# EAGLE design HM-RC-8_Remote-v03-019 (EAGLE 9.5.0)
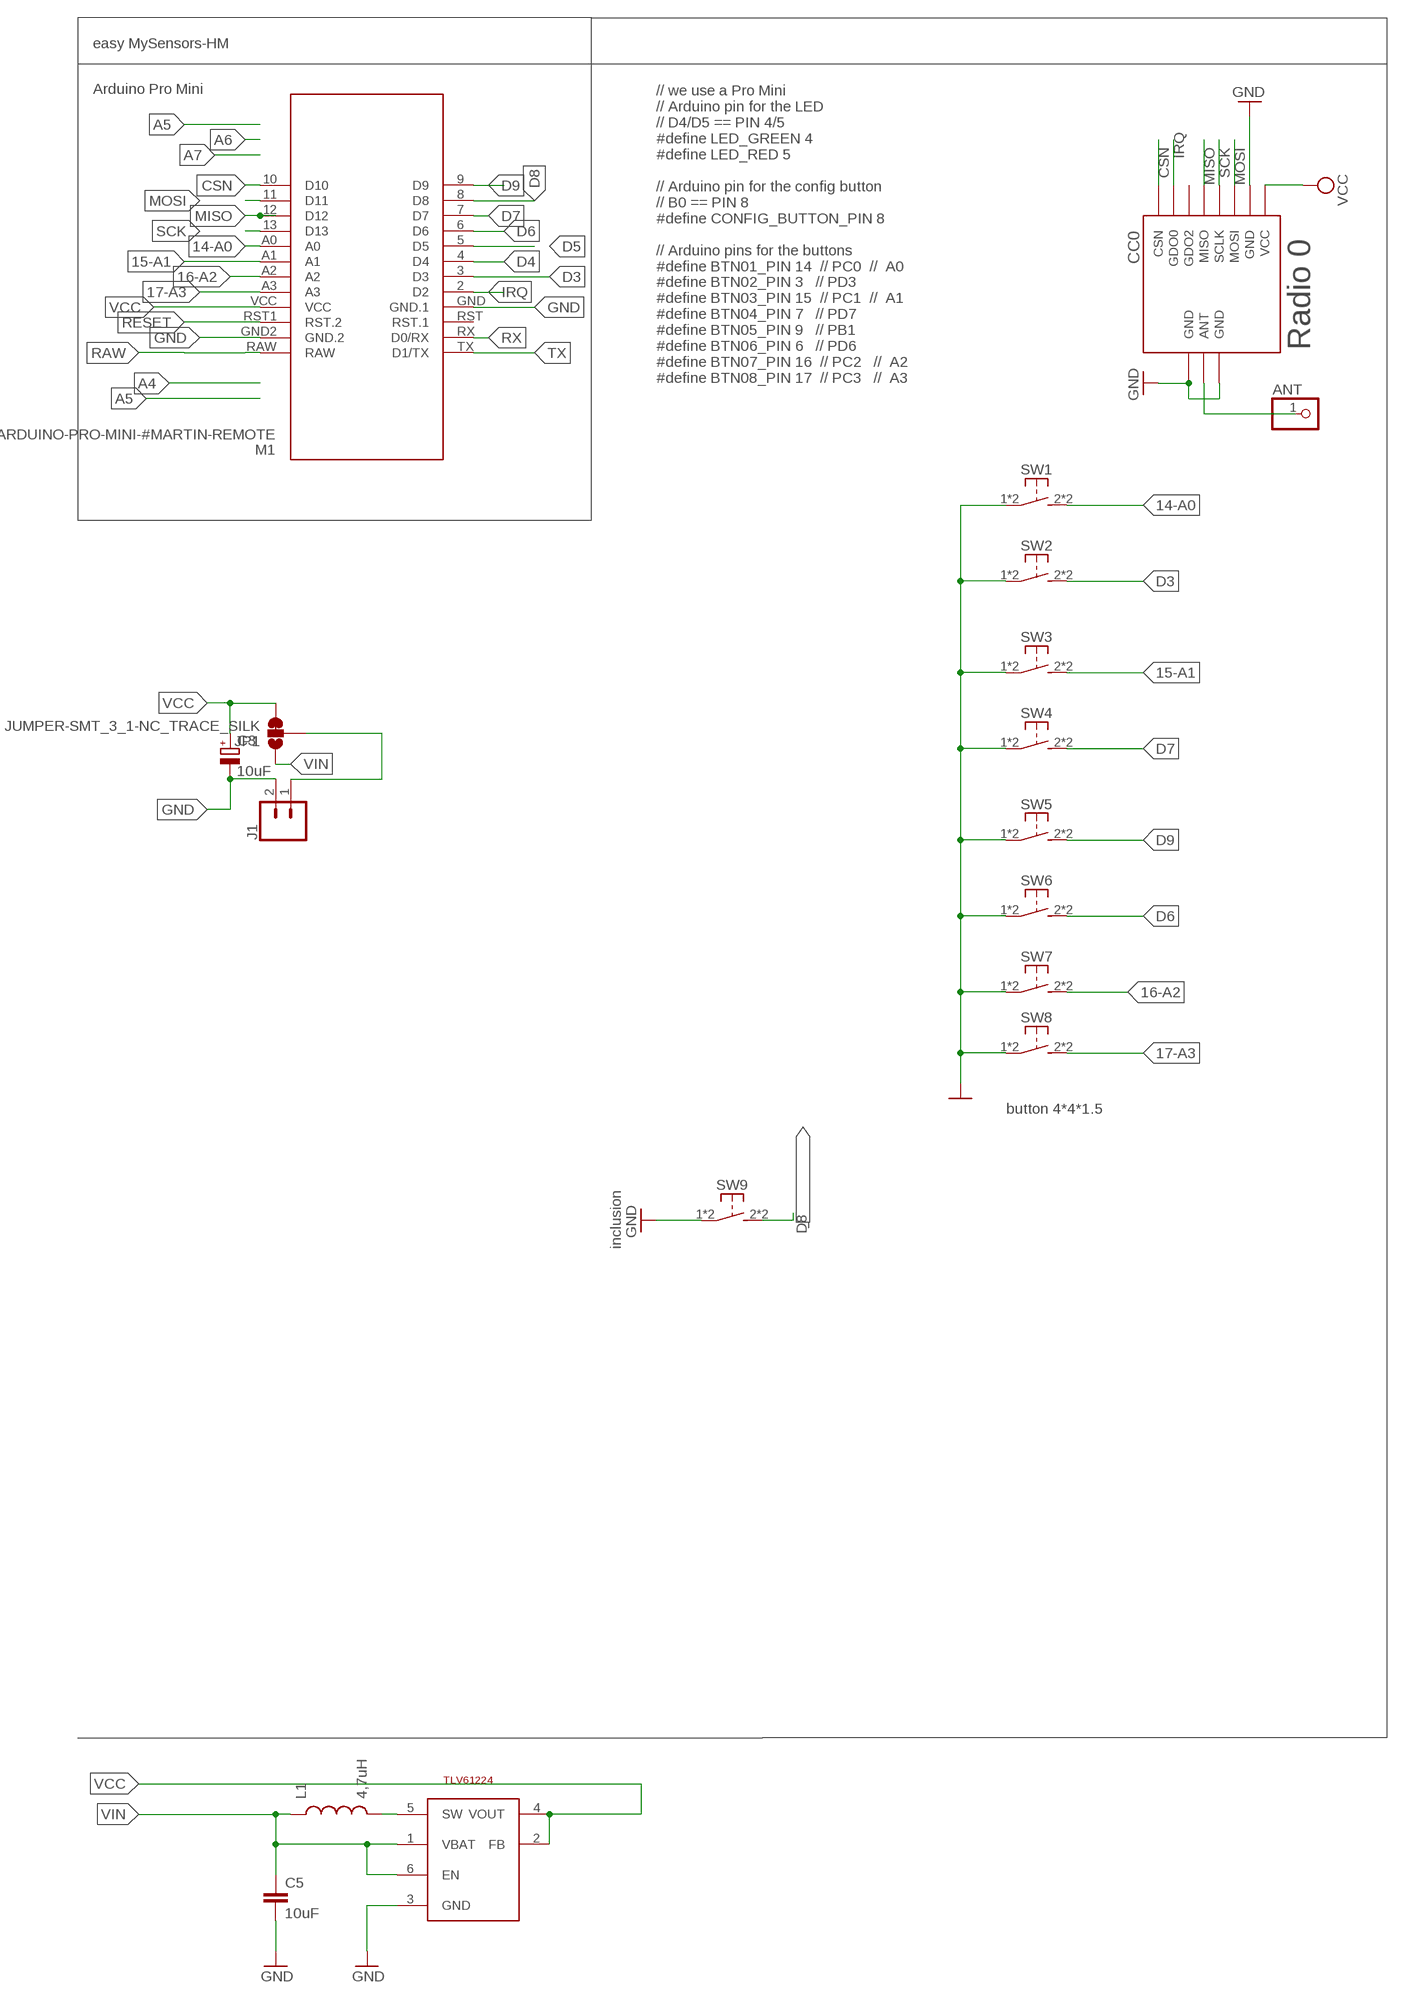
[diagram p0: schematic, sheet 1]

## Parts
ANT  PINHD-1X1  [1X01]
C3  10uF  CPOL-EUSMCC  [SMC_C]
C5  10uF  CAP0805  [0805]
CC0  CC1101  CC1101_MODULE1SMD  [CC1101_MODULE1_SMD]
J1  CONN_02PTH3  [1X02_LONGPADS]
JP1  JUMPER-SMT_3_1-NC_TRACE_SILK  [SMT-JUMPER_3_1-NC_TRACE_SILK]
L1  4,7uH  INDUCTOR0805  [0805]
M1  ARDUINO-PRO-MINI-#MARTIN-REMOTE  [ARDUINO-PRO-MINI#NP-MARTIN-REMOTE]
STEPUP  TLV61224  TI-TLV61224  [SOT23-6L]
SW1  SW-TACTILE-TL3305  [TL3305]
SW2  SW-TACTILE-TL3305  [TL3305]
SW3  SW-TACTILE-TL3305  [TL3305]
SW4  SW-TACTILE-TL3305  [TL3305]
SW5  SW-TACTILE-TL3305  [TL3305]
SW6  SW-TACTILE-TL3305  [TL3305]
SW7  SW-TACTILE-TL3305  [TL3305]
SW8  SW-TACTILE-TL3305  [TL3305]
SW9  SW-TACTILE-TL3305  [TL3305]

## Nets
14-A0: M1.A0 SW1.2(S1) SW1.3(S1)
15-A1: M1.A1 SW3.2(S1) SW3.3(S1)
16-A2: M1.A2 SW7.2(S1) SW7.3(S1)
17-A3: M1.A3 SW8.2(S1) SW8.3(S1)
ANT0: ANT.1 CC0.ANT
CSN: CC0.CSN M1.10(D10)
D3: M1.3(D3) SW2.2(S1) SW2.3(S1)
D4: M1.4(D4)
D5: M1.5(D5)
D6: M1.6(D6) SW6.2(S1) SW6.3(S1)
D7: M1.7(D7) SW4.2(S1) SW4.3(S1)
D8: M1.8(D8) SW9.2(S1) SW9.3(S1)
D9: M1.9(D9) SW5.2(S1) SW5.3(S1)
GND [Power]: C3.- C5.2 CC0.GND@0(GND) CC0.GND@1(GND) CC0.GND@2(GND) J1.2 M1.GND2(GND.2) M1.GND(GND.1) STEPUP.3(GND) SW1.1 SW1.4(P1) SW2.1 SW2.4(P1) SW3.1 SW3.4(P1) SW4.1 SW4.4(P1) SW5.1 SW5.4(P1) SW6.1 SW6.4(P1) SW7.1 SW7.4(P1) SW8.1 SW8.4(P1) SW9.1 SW9.4(P1)
IRQ: CC0.GDO0 M1.2(D2)
MISO: CC0.MISO M1.12(D12)
MOSI: CC0.MOSI M1.11(D11)
N$4: J1.1 JP1.2
N$13: L1.2 STEPUP.5(SW)
RAW [Power]: M1.RAW
RESET: M1.RST1(RST.2)
RX: M1.RX(D0/RX)
SCK: CC0.SCLK M1.13(D13)
TX: M1.TX(D1/TX)
VCC [Power]: C3.+ CC0.VCC JP1.3 M1.VCC STEPUP.2(FB) STEPUP.4(VOUT)
VIN: C5.1 JP1.1 L1.1 STEPUP.1(VBAT) STEPUP.6(EN)
Unconnected: CC0.GDO2 M1.RST(RST.1)

## Notes on the sheet
- easy MySensors-HM
- Arduino Pro Mini
- Radio 0
- // we use a Pro Mini
  // Arduino pin for the LED
  // D4/D5 == PIN 4/5
  #define LED_GREEN 4
  #define LED_RED 5
  
  // Arduino pin for the config button
  // B0 == PIN 8
  #define CONFIG_BUTTON_PIN 8
  
  // Arduino pins for the buttons
  #define BTN01_PIN 14  // PC0  //  A0
  #define BTN02_PIN 3   // PD3  
  #define BTN03_PIN 15  // PC1  //  A1
  #define BTN04_PIN 7   // PD7
  #define BTN05_PIN 9   // PB1
  #define BTN06_PIN 6   // PD6
  #define BTN07_PIN 16  // PC2   //  A2
  #define BTN08_PIN 17  // PC3   //  A3
- button 4*4*1.5
- inclusion

## Library data of the parts
ANT = pinhead:PINHD-1X1: PIN HEADER
C3 = rcl:CPOL-EU: POLARIZED CAPACITOR, European symbol; SPICEPREFIX: C
C5 = SparkFun-Passives:CAP: Capacitor Standard 0603 ceramic capacitor, and 0.1" leaded capacitor.
CC0 = wireless:CC1101_MODULE1: CC1101 wireless module for 433/868 MHz (sold from Aliexpress). DIL version for mounting with pin header (and SMD soldering) and SMD only variant available.
J1 = SparkFun-Connectors:CONN_02: Multi connection point. Often used as Generic Header-pin footprint for 0.1 inch spaced/style header connections On any of the 0.1 inch spaced packages, you can populate with these: Break Away Headers - Straight <https://www.sparkfun.com/products/116> (PRT-00116) Break Away Male Headers - Right Angle <https://www.sparkfun.com/products/553> (PRT-00553) Female Headers <https://www.sparkfun.com/products/115> (PRT-00115) Break Away Headers - Machine Pin <https://www.sparkfun.com/products/117> (PRT-00117) Break Away Female Headers - Swiss Machine Pin <https://www.sparkfun.com/products/743> (PRT-00743) For SCREWTERMINALS and SPRING TERMINALS visit here: Screw Terimnals on SparkFun.com <https://www.sparkfun.com/search/results?term=Screw+Terminals> (5mm/3.5mm/2.54mm spacing) This device is also useful as a general connection point to wire up your design to another part of your project. Our various solder wires solder well into these plated through hole pads. Hook-Up Wire - Assortment (Stranded, 22 AWG) <https://www.sparkfun.com/products/11375> (PRT-11375) Hook-Up Wire - Assortment (Solid Core, 22 AWG) <https://www.sparkfun.com/products/11367> (PRT-11367) View the entire wire category on our website here <https://www.sparkfun.com/categories/141> Special notes: Molex polarized connector foot print use with: PRT-08233 with associated crimp pins and housings. 2.54_SCREWTERM for use with PRT-10571. 3.5mm Screw Terminal footprints for PRT-08084 5mm Screw Terminal footprints for use with PRT-08432
JP1 = SparkFun-Jumpers:JUMPER-SMT_3_1-NC_TRACE: Normally closed trace jumper (1 of 2 connections) This jumper has a trace between two pads so it's normally closed (NC). The other connection is normally open (NO). Use a razor knife to open the connection. For best results follow the IPC guidelines for cutting traces: Cutout at least 0.063 mm (0.005 in). Remove all loose material to clean up the cut area. Seal the cut with an approved epoxy. Reapply solder to reclose the connection, or to close the NO connection.
L1 = SparkFun-Passives:INDUCTOR: Inductors Basic Inductor/Choke - 0603 and 1206. Footprints are not proven and vary greatly between part numbers.
M1 = diy-modules-Martin:ARDUINO-PRO-MINI-*#MARTIN-REMOTE: Arduino Pro Mini (and compatible devices) without programming pads More details available here: https://www.arduino.cc/en/Main/ArduinoBoardProMini Click here to find device on ebay.com <http://www.ebay.com/sch/arduino+pro+mini>
STEPUP = TLV61224:TI-TLV61224
SW1-SW9 = we-switch:SW-TACTILE: Tactile Switches

## Net classes
0 default: width 0.305 mm
1 Power: width 0.508 mm

## Board
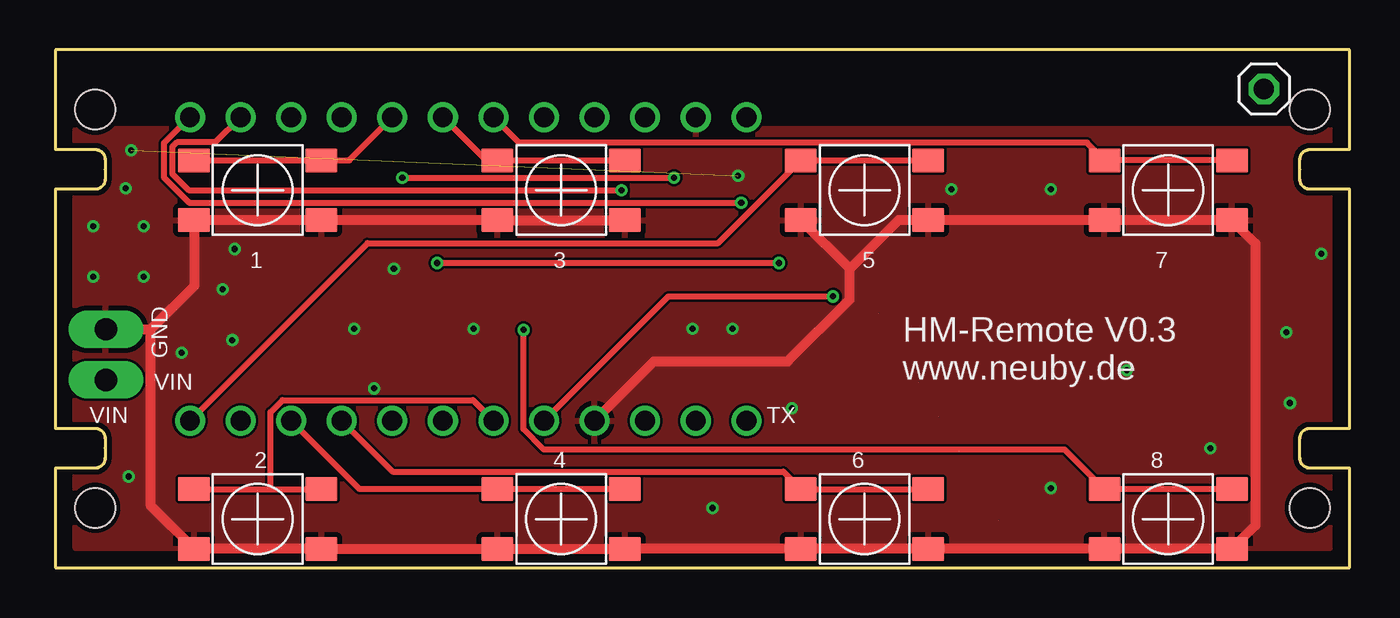
[diagram p1: board, top side]
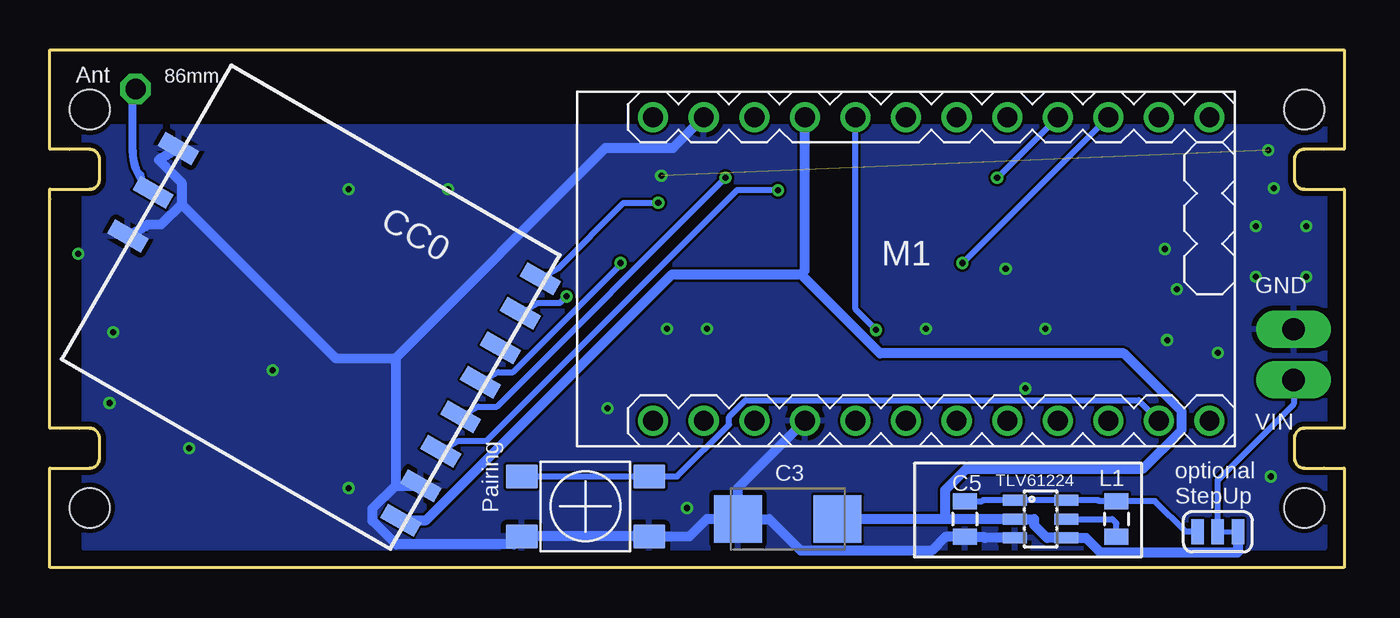
[diagram p2: board, bottom side, seen from below]

Size 65 x 26 mm. Coordinates in mm from the lower left corner, seen from the top.
Outline: 0,0 65,0 65,5 63,5 arc-90 62.5,5.5 62.5,6.5 arc-90 63,7 63.5,7 64.5,7 65,7 65,18.5 65,19 63,19 arc-90 62.5,19.5 62.5,20 62.5,20.5 arc-90 63,21 64,21 65,21 65,26 0,26 0,21 1,21 2,21 arc-90 2.5,20.5 2.5,20 2.5,19.5 arc-90 2,19 0,19 0,7 2,7 arc-90 2.5,6.5 2.5,6 2.5,5.5 arc-90 2,5 1,5 0,5 0,0
Copper layers (1*16): Top 0.035mm / dielectric 1.5mm / Bottom 0.035mm
Design rules "dirt_cheap_dirty_boards.v1": minimum track width 5mil, minimum drill 12mil, track to track 5mil, track to pad 5mil, pad to pad 5mil, via to via 5mil, smd to smd 0mil, copper to edge 10mil, drill to drill 10mil, minimum pad ring 10mil, minimum via ring 6mil, stop-mask expansion 2mil, vias tented up to drill 25mil, thermal gap 10mil
Holes 2 mm at 2,3 2,23 63,23 63,3
tRestrict: area 1,24 to 59,26
bRestrict: area 1,24 to 59,26

### Footprints (pad centres in the part's own frame; a part is rotated, then mirrored left to right if it is on the bottom)
1X01 = drill 1.016 octagon: 1 0,0
SMC_C = smd 2.4 x 2.4: + -2.5,0; - 2.5,0
0805 = smd 0.8 x 1.2: 1 -0.9,0; 2 0.9,0
CC1101_MODULE1_SMD = smd 1.93 x 0.813: ANT 19,5.96; CSN 0,0; GDO0 0,2; GDO2 0,4; GND@0 0,12; GND@1 19,8.5; GND@2 19,3.42; MISO 0,6; MOSI 0,10; SCLK 0,8; VCC 0,14
1X02_LONGPADS = drill 1.118 pad 1.88 long: 1 0,0; 2 2.54,0
SMT-JUMPER_3_1-NC_TRACE_SILK = smd 0.635 x 1.27: 1 -1.016,0; 2 0,0; 3 1.016,0
ARDUINO-PRO-MINI#NP-MARTIN-REMOTE = drill 1: 2 -2.54,-7.62; 3 0,-7.62; 4 2.54,-7.62; 5 5.08,-7.62; 6 7.62,-7.62; 7 10.16,-7.62; 8 12.7,-7.62; 9 15.24,-7.62; 10 15.24,7.62; 11 12.7,7.62; 12 10.16,7.62; 13 7.62,7.62; A0 5.08,7.62; A1 2.54,7.62; A2 0,7.62; A3 -2.54,7.62; GND -10.16,7.62; GND2 -5.08,-7.62; RAW -12.7,7.62; RST -7.62,7.62; RST1 -7.62,-7.62; RX -10.16,-7.62; TX -12.7,-7.62; VCC -5.08,7.62
SOT23-6L = smd 0.55 x 1.2: 1 -0.95,-1.3; 2 0,-1.3; 3 0.95,-1.3; 4 0.95,1.3; 5 0,1.3; 6 -0.95,1.3
TL3305 = smd 1.6 x 1.2: 1 -3.2,1.5; 2 -3.2,-1.5; 3 3.2,-1.5; 4 3.2,1.5

### Placement (x,y rotation side)
ANT  60.69,24.04 0 top
C3  27.94,2.44 180 bottom
C5  19.05,2.44 270 bottom
CC0  40.37,14.51 150 bottom
J1  2.54,9.43 90 top
JP1  6.35,1.81 0 bottom
L1  11.43,2.44 270 bottom
M1  22,15 0 bottom
STEPUP  15.24,2.44 270 bottom
SW1  10.16,18.95 180 top
SW2  10.16,2.44 180 top
SW3  25.4,18.95 180 top
SW4  25.4,2.44 180 top
SW5  40.64,18.95 180 top
SW6  40.64,2.44 180 top
SW7  55.88,18.95 180 top
SW8  55.88,2.44 180 top
SW9  38.1,3.08 180 bottom

### Tracks (layer width: path | path; a pad name or v marks a point on that pad's centre or on a via)
14-A0
  Top 0.305: M1.A0 14.76,20.45 SW1.2 SW1.3
15-A1
  Top 0.305: SW3.2 SW3.3 21.62,20.45 M1.A1
16-A2
  Top 0.305: M1.A2 23.29,21.33 51.8,21.33 SW7.3 SW7.2
17-A3  (via drill 0.3 pad 0.61)
  Top 0.305: v23.5,11.94 23.5,6.95 24.52,5.93 50.69,5.93 SW8.3 SW8.2
  Bottom 0.305: v23.5,11.94 24.54,12.97 M1.A3
ANT0
  Bottom 0.305: CC0.ANT 60.3,19.34 arc45 60.45,19.72
  Bottom 0.406: 60.45,19.72 arc-45 60.3,19.34 CC0.ANT 60.09,19.13 arc45 60.83,20.93 60.83,23.69 arc45 ANT.1
CSN  (via drill 0.3 pad 0.61)
  Top 0.305: M1.10 5.45,21.32 5.45,19.6 6.71,18.33 34.42,18.33 v34.44,18.32
  Bottom 0.305: v34.44,18.32 36.19,18.32 39.49,15.02 CC0.CSN
D3
  Top 0.305: 10.8,3.94 SW2.2 | SW2.3 10.8,3.94 | 10.8,3.94 10.8,7.81 11.41,8.41 20.97,8.41 M1.3
D6
  Top 0.305: M1.6 16.93,4.83 36.56,4.83 SW6.3 SW6.2
D7
  Top 0.305: M1.7 15.28,3.94 SW4.3 SW4.2
D8
  Bottom 0.305: M1.8 10.34,8.41 30.05,8.41 30.89,7.58 30.89,7.18 33.49,4.58 SW9.2 SW9.3
D9
  Top 0.305: SW5.2 SW5.3 33.29,16.3 15.68,16.3 M1.9
GND  (via drill 0.3 pad 0.61)  (1 unrouted)
  Top 0.508: 39.89,15 SW5.4 | M1.GND2 30.06,10.36 36.77,10.36 39.89,13.48 39.89,15 | 39.89,15 42.34,17.45 SW5.1 SW7.4 SW7.1 60.26,16.27 60.26,2.13 SW8.1 SW8.4 SW6.1 SW6.4 SW4.1 SW4.4 SW2.1 SW2.4 4.8,3.1 4.8,11.97 | 4.8,11.97 6.96,14.13 SW1.4 SW1.1 SW3.4 SW3.1 | J1.2 4.8,11.97
  Bottom 0.508: 47.65,10.53 37.09,21.08 33.7,21.08 M1.GND | 58.38,18.26 50.65,10.53 47.65,10.53 | 47.65,10.53 47.65,4.12 | 47.65,4.12 CC0.GND@0 | 47.65,4.12 48.79,2.97 48.79,2.35 47.61,1.17 41.71,1.17 SW9.4 SW9.1 32.89,1.58 32.02,2.44 C3.- | 58.38,18.26 58.38,19.33 59.53,20.47 CC0.GND@2 | 58.38,18.26 59.42,17.22 60.08,17.22 | 60.08,17.22 | C3.- 28.86,2.44 27.28,0.86 20.71,0.86 20.03,1.54 C5.2 18.56,1.54 18.07,1.54 18.02,1.5 STEPUP.3 | CC0.GND@1 60.08,17.22 | C3.- 30.44,4.03 30.43,4.03 M1.GND2
  other vias: 3.67,4.58 8.4,13.98 1.91,14.61 4.45,14.61 3.81,20.95 3.54,19.05 1.91,17.14 34.29,19.68 4.45,17.14 8.89,11.43 6.35,10.79 9,16 15,12 17,15 21,12 16,9 32,12 34,12 37,8 33,3 50,4 58,6 61.81,11.82 50,19 45,19 53.81,9.92 63.58,15.76 62,8.27
  pour Bottom: 1,1 63.25,1 63.25,22.13 1,22.13
  pour Top: 1,1 64,1 64,22 1,22
IRQ  (via drill 0.3 pad 0.61)  (1 unrouted)
  Top 0.305: M1.2 30.78,13.62 v39.06,13.62
  Bottom 0.305: CC0.GDO0 40.49,13.29 | v39.06,13.62 39.39,13.29 40.49,13.29 | 40.49,13.29
MISO  (via drill 0.3 pad 0.61)  (1 unrouted)
  Top 0.305: v36.34,15.3 v19.16,15.3
  Bottom 0.305: CC0.MISO 42.49,9.82 41.73,9.82 36.34,15.21 v36.34,15.3 | M1.12 v19.16,15.3
MOSI  (via drill 0.3 pad 0.61)  (1 unrouted)
  Top 0.305: M1.11 8.04,21.36 6.1,21.36 5.88,21.14 5.88,19.78 6.7,18.95 v28.44,18.95
  Bottom 0.305: CC0.MOSI 44.49,6.36 | v28.44,18.95 30.49,18.95 43.09,6.36 44.49,6.36 | 44.49,6.36
N$4
  Bottom 0.305: J1.1 2.54,8.21 6.35,4.4 JP1.2
N$13
  Bottom 0.305: L1.2 11.43,2.22 11.65,2.44 STEPUP.5
SCK  (via drill 0.3 pad 0.61)  (1 unrouted)
  Top 0.305: v17.42,19.58 v31.07,19.58
  Bottom 0.305: 43.49,8.09 | 43.49,8.09 42.55,8.09 v31.07,19.58 | M1.13 v17.42,19.58 | CC0.SCLK 43.49,8.09
VCC  (1 unrouted)
  Bottom 0.508: 27.27,14.73 27.08,14.93 M1.VCC | CC0.VCC 46.09,2.39 33.75,14.73 27.27,14.73 | 20.04,2.44 20.04,3.91 18.97,4.97 10.1,4.97 8.16,6.91 8.16,7.85 11.07,10.76 23.3,10.76 27.27,14.73 | 20.04,2.44 C3.+ | 20.04,2.44 STEPUP.2 16.05,2.44 15.56,2.44 15.56,2.13 14.92,1.5 STEPUP.4 12.96,1.5 12.23,0.76 5.36,0.76 5.33,0.79 JP1.3
VIN
  Bottom 0.305: JP1.1 7.96,1.81 9.5,3.35 L1.1 12.31,3.35 12.36,3.4 STEPUP.6 STEPUP.1 18.12,3.4 18.17,3.35 C5.1

### Text on the board
tNames: 1 | 3 | 5 | 7 | GND | VIN | HM-Remote V0.3 / www.neuby.de | VIN | TX | 2 | 4 | 6 | 8
bNames: 86mm | Ant | GND | VIN | Pairing | optional | L1 | TLV61224 | C5 | C3 | StepUp